# Altium schematic sheet SuperFin Baseboard pg3.SchDoc
size A
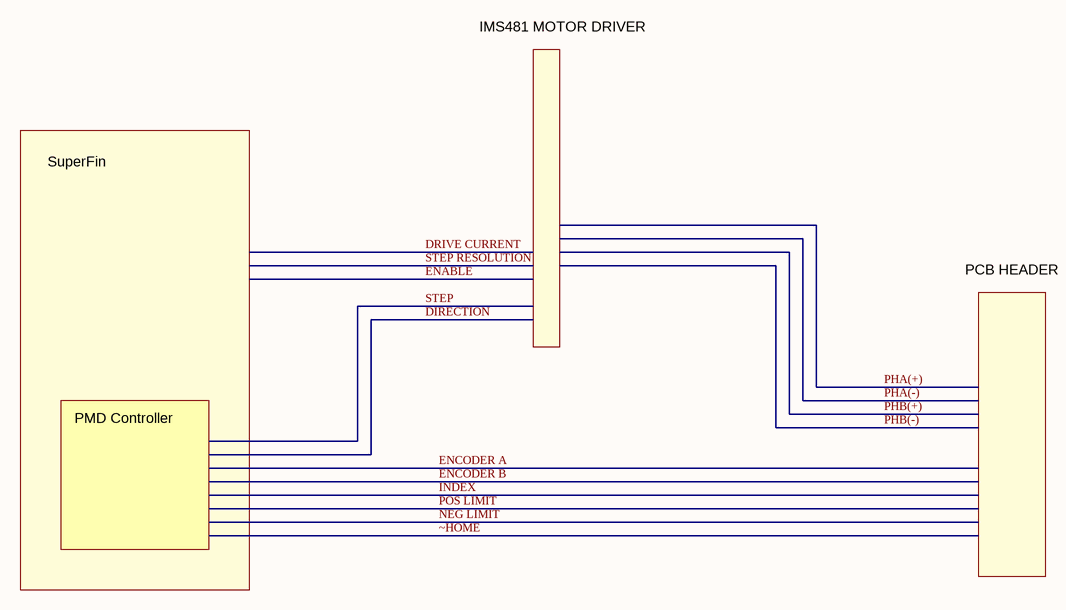
[diagram p0: SuperFin Baseboard pg3.SchDoc]

## Notes on the sheet
- IMS481 MOTOR DRIVER
- SuperFin
- PCB HEADER
- PMD Controller